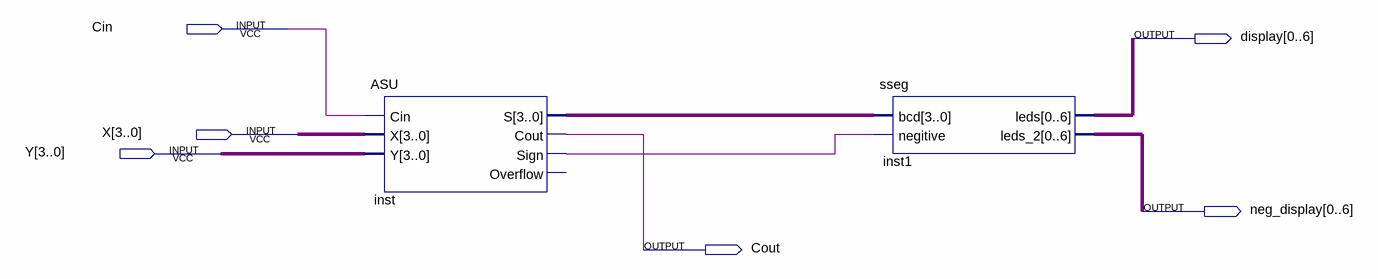
[diagram p0: schematic sheet]
// Quartus schematic CombinedASU1.bdf as structural Verilog: 2 symbols, 6 pins
module CombinedASU1 (
  input  Cin,
  input  [3:0] X,
  input  [3:0] Y,
  output [0:6] display,
  output [0:6] neg_display,
  output Cout
);

  wire inst_sign;
  wire [3:0] inst_s;

  ASU inst (.Cin(Cin), .X(X), .Y(Y), .S(inst_s), .Cout(Cout), .Sign(inst_sign));  // open: Overflow
  sseg inst1 (.bcd(inst_s), .negitive(inst_sign), .leds(display), .leds_2(neg_display));
endmodule
